# Altium schematic sheet POWER.SchDoc
size A3
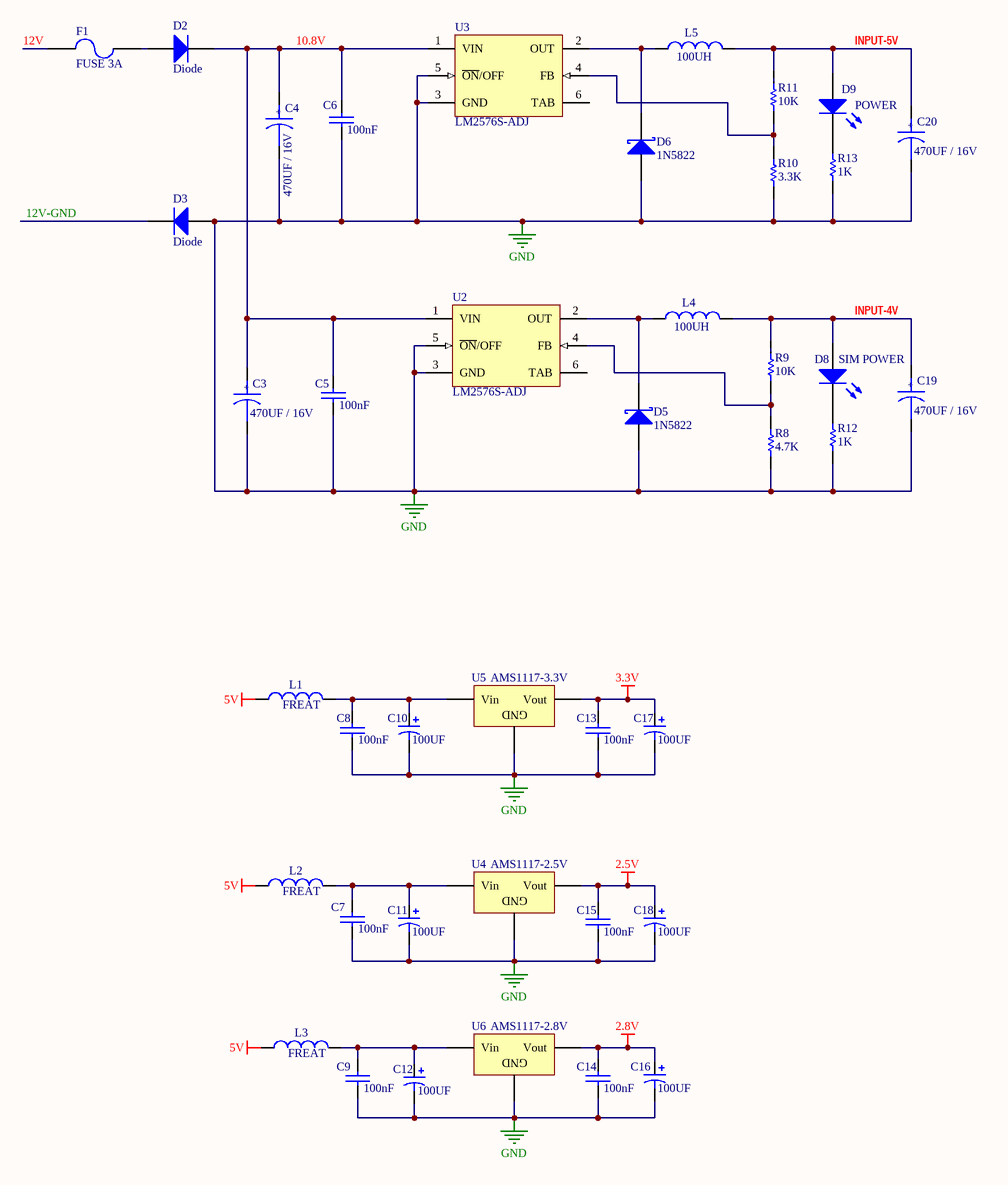
[diagram p0: POWER.SchDoc]

## Parts
C3  470UF / 16V  [470UF-SMD]
C4  470UF / 16V  [470UF-SMD]
C5  100nF  [0805C]
C6  100nF  [0805C]
C7  100nF  [0805C]
C8  100nF  [0805C]
C9  100nF  [0805C]
C10  value 100UF  [100UF-SMD]  (hidden comment: 100uF / 16V SMD)
C11  value 100UF  [100uf-smd]  (hidden comment: 100uF / 16V SMD)
C12  value 100UF  [100uf-smd]  (hidden comment: 100uF / 16V SMD)
C13  100nF  [0805C]
C14  100nF  [0805C]
C15  100nF  [0805C]
C16  value 100UF  [100uf-smd]  (hidden comment: 100uF / 16V SMD)
C17  value 100UF  [100uf-smd]  (hidden comment: 100uF / 16V SMD)
C18  value 100UF  [100uf-smd]  (hidden comment: 100uF / 16V SMD)
C19  470UF / 16V  [470UF-SMD]
C20  470UF / 16V  [470UF-SMD]
D2  Diode  [Diode]
D3  Diode  [Diode]
D5  1N5822  [SMB]
D6  1N5822  [SMB]
D8  Publisher: SIM POWER  [0805D]  (hidden comment: LED)
D9  LED  [0805D]  (value not drawn)
F1  FUSE 3A  [FUSE]
L1  FREAT  [1206]
L2  FREAT  [1206]
L3  FREAT  [1206]
L4  100UH  [100UH 1]
L5  100UH  [100UH 1]
R8  4.7K  [0805]
R9  10K  [0805]
R10  3.3K  [0805]
R11  10K  [0805]
R12  1K  [0805]
R13  1K  [0805]
U2  LM2576S-ADJ  [TS5B_N]
U3  LM2576S-ADJ  [TS5B_N]
U4  AMS1117-2.5V  [sot223]
U5  AMS1117-3.3V  [sot223]
U6  AMS1117-2.8V  [sot223]

## Nets
2.5V: C15.1 C18.1 U4.2(Vout)
2.8V: C14.1 C16.1 U6.2(Vout)
3.3V: C13.1 C17.1 U5.2(Vout)
5V: L1.1 L2.1 L3.1
GND: C3.2 C4.2 C5.2 C6.2 C7.2 C8.2 C9.2 C10.2 C11.2 C12.2 C13.2 C14.2 C15.2 C16.2 C17.2 C18.2 C19.2 C20.2 D3.1(A) D5.1(A) D6.1(A) R8.1 R10.1 R12.2 R13.2 U2.3(GND) U2.5(~{ON}/OFF) U3.3(GND) U3.5(~{ON}/OFF) U4.1(GND) U5.1(GND) U6.1(GND)
10.8V: C3.1 C4.1 C5.1 C6.1 D2.2(K) U2.1(VIN) U3.1(VIN)
12V: F1.1
12V-GND: D3.2(K)
INPUT-4V: C19.1 D8.1(A) L4.2 R9.2
INPUT-5V: C20.1 D9.1(A) L5.2 R11.2
NetC7_1: C7.1 C11.1 L2.2 U4.3(Vin)
NetC8_1: C8.1 C10.1 L1.2 U5.3(Vin)
NetC9_1: C9.1 C12.1 L3.2 U6.3(Vin)
NetD2_1: D2.1(A) F1.2
NetD5_2: D5.2(K) L4.1 U2.2(OUT)
NetD6_2: D6.2(K) L5.1 U3.2(OUT)
NetD8_2: D8.2(K) R12.1
NetD9_2: D9.2(K) R13.1
NetR8_2: R8.2 R9.1 U2.4(FB)
NetR10_2: R10.2 R11.1 U3.4(FB)

Not connected (* = marked no-connect by the designer): U2 6(TAB); U3 6(TAB)

## Notes on the sheet
- (in symbol CAPACITOR POL) +

## Library data of the parts
C3 C4 C19 C20 = CAPACITOR POL: Capacitor; Section Code: 12117032
C5-C9 C13-C15 = CAP
C10-C12 C16-C18 = Cap Pol1: Polarized Capacitor (Radial); Published: 8-Jun-2000; LatestRevisionDate: 17-Jul-2002; LatestRevisionNote: Re-released for DXP Platform.; PackageReference: RB7.6-15; Publisher: Altium Limited
D2 D3 = Diode: Default Diode; Published: 8-Jun-2000; LatestRevisionDate: 17-Jul-2002; LatestRevisionNote: Re-released for DXP Platform.; PackageDocument: Sep-1996; PackageReference: SMC; Publisher: Altium Limited; Code_JEDEC: DO-214-AB
D5 D6 = D Schottky: Schottky Diode; Published: 8-Jun-2000; LatestRevisionDate: 17-Jul-2002; LatestRevisionNote: Re-released for DXP Platform.; PackageReference: SMB; Publisher: Altium Limited; Code_JEDEC: DO-214-AA
D8 D9 = LED3: Typical BLUE SiC LED; Published: 8-Jun-2000; LatestRevisionDate: 17-Dec-2003; LatestRevisionNote: PCB Footprint replaced.; DatasheetVersion: 16-Apr-2002; PackageVersion: 16-Apr-2002; PackageReference: 3.5X2.8X1.9; PackageDescription: SM LED; 2 C-Bend Leads; Body 3.5 x 2.8 x 1.9 mm, inc leads (LxWxH typ)
  D9: POWER: POWER
F1 = FUSE2: Fuse
L1-L5 = Inductor: Code_IEC: 1005; Value: 250mA; Published: 8-Jun-2000; LatestRevisionDate: 29-May-2009; LatestRevisionNote: IPC-7351 Footprint Added.; PackageReference: 0402-A; Publisher: Altium Limited; PackageDescription: Chip Inductor; Code_JEITA: 0402
R8-R11 = Res Semi: Semiconductor Resistor; Published: 8-Jun-2000; LatestRevisionDate: 17-Jul-2002; LatestRevisionNote: Re-released for DXP Platform.; PackageReference: AXIAL-0.5; Publisher: Altium Limited
  R8: Value: 4.7K
  R9 R11: Value: 10K
  R10: Value: 3.3K
R12 R13 = Res1: Resistor; Published: 8-Jun-2000; Revision: July-2002: Re-released for DXP Platform.; Publisher: Altium Limited; Value: 1K
U2 U3 = LM2576S-ADJ: SIMPLE SWITCHER® 3A Step-Down Voltage Regulator, 5-pin TO-263; Manufacturer: National Semiconductor; PackageTopMarking: NSUZXYTTE#*LM2576S*-ADJ P+; PowerWise: N; Published: 4-Dec-2008; DatasheetVersion: Aug-2004; PackageVersion: revD, Apr-2005; PackageReference: TS5B; Publisher: Altium Limited; PackageDescription: TO-263, Molded, .400 x .390 x .180in, 5 Lead, .067in Pitch, Surface Mount; PartNumber: LM2576S-ADJ; RoHS: N; PinCount: 5; CompType: Switcher; Code_JEDEC: MO-169-AB; ComponentLink1Description: LM2576 Datasheet; ComponentLink1URL: http://www.national.com/ds/LM/LM2576.pdf; ComponentLink2Description: LM2576 Web Page; ComponentLink2URL: http://www.national.com/pf/LM/LM2576.html; ComponentLink3Description: TS5B Package Page; ComponentLink3URL: http://www.national.com/packaging/folders/ts5b.html
U4-U6 = Volt Reg: Voltage Regulator; Published: 24-Mar-1999; LatestRevisionDate: 17-Jul-2002; LatestRevisionNote: Re-released for DXP Platform.; PackageReference: D2PAK; Publisher: Altium Limited; Code_JEDEC: SMD-220